# Altium schematic sheet MainPCB.SchDoc: Main PCB
size A3; DrawnBy: FeKunz; Revision: 1; SheetNumber: 1; SheetTotal: 1
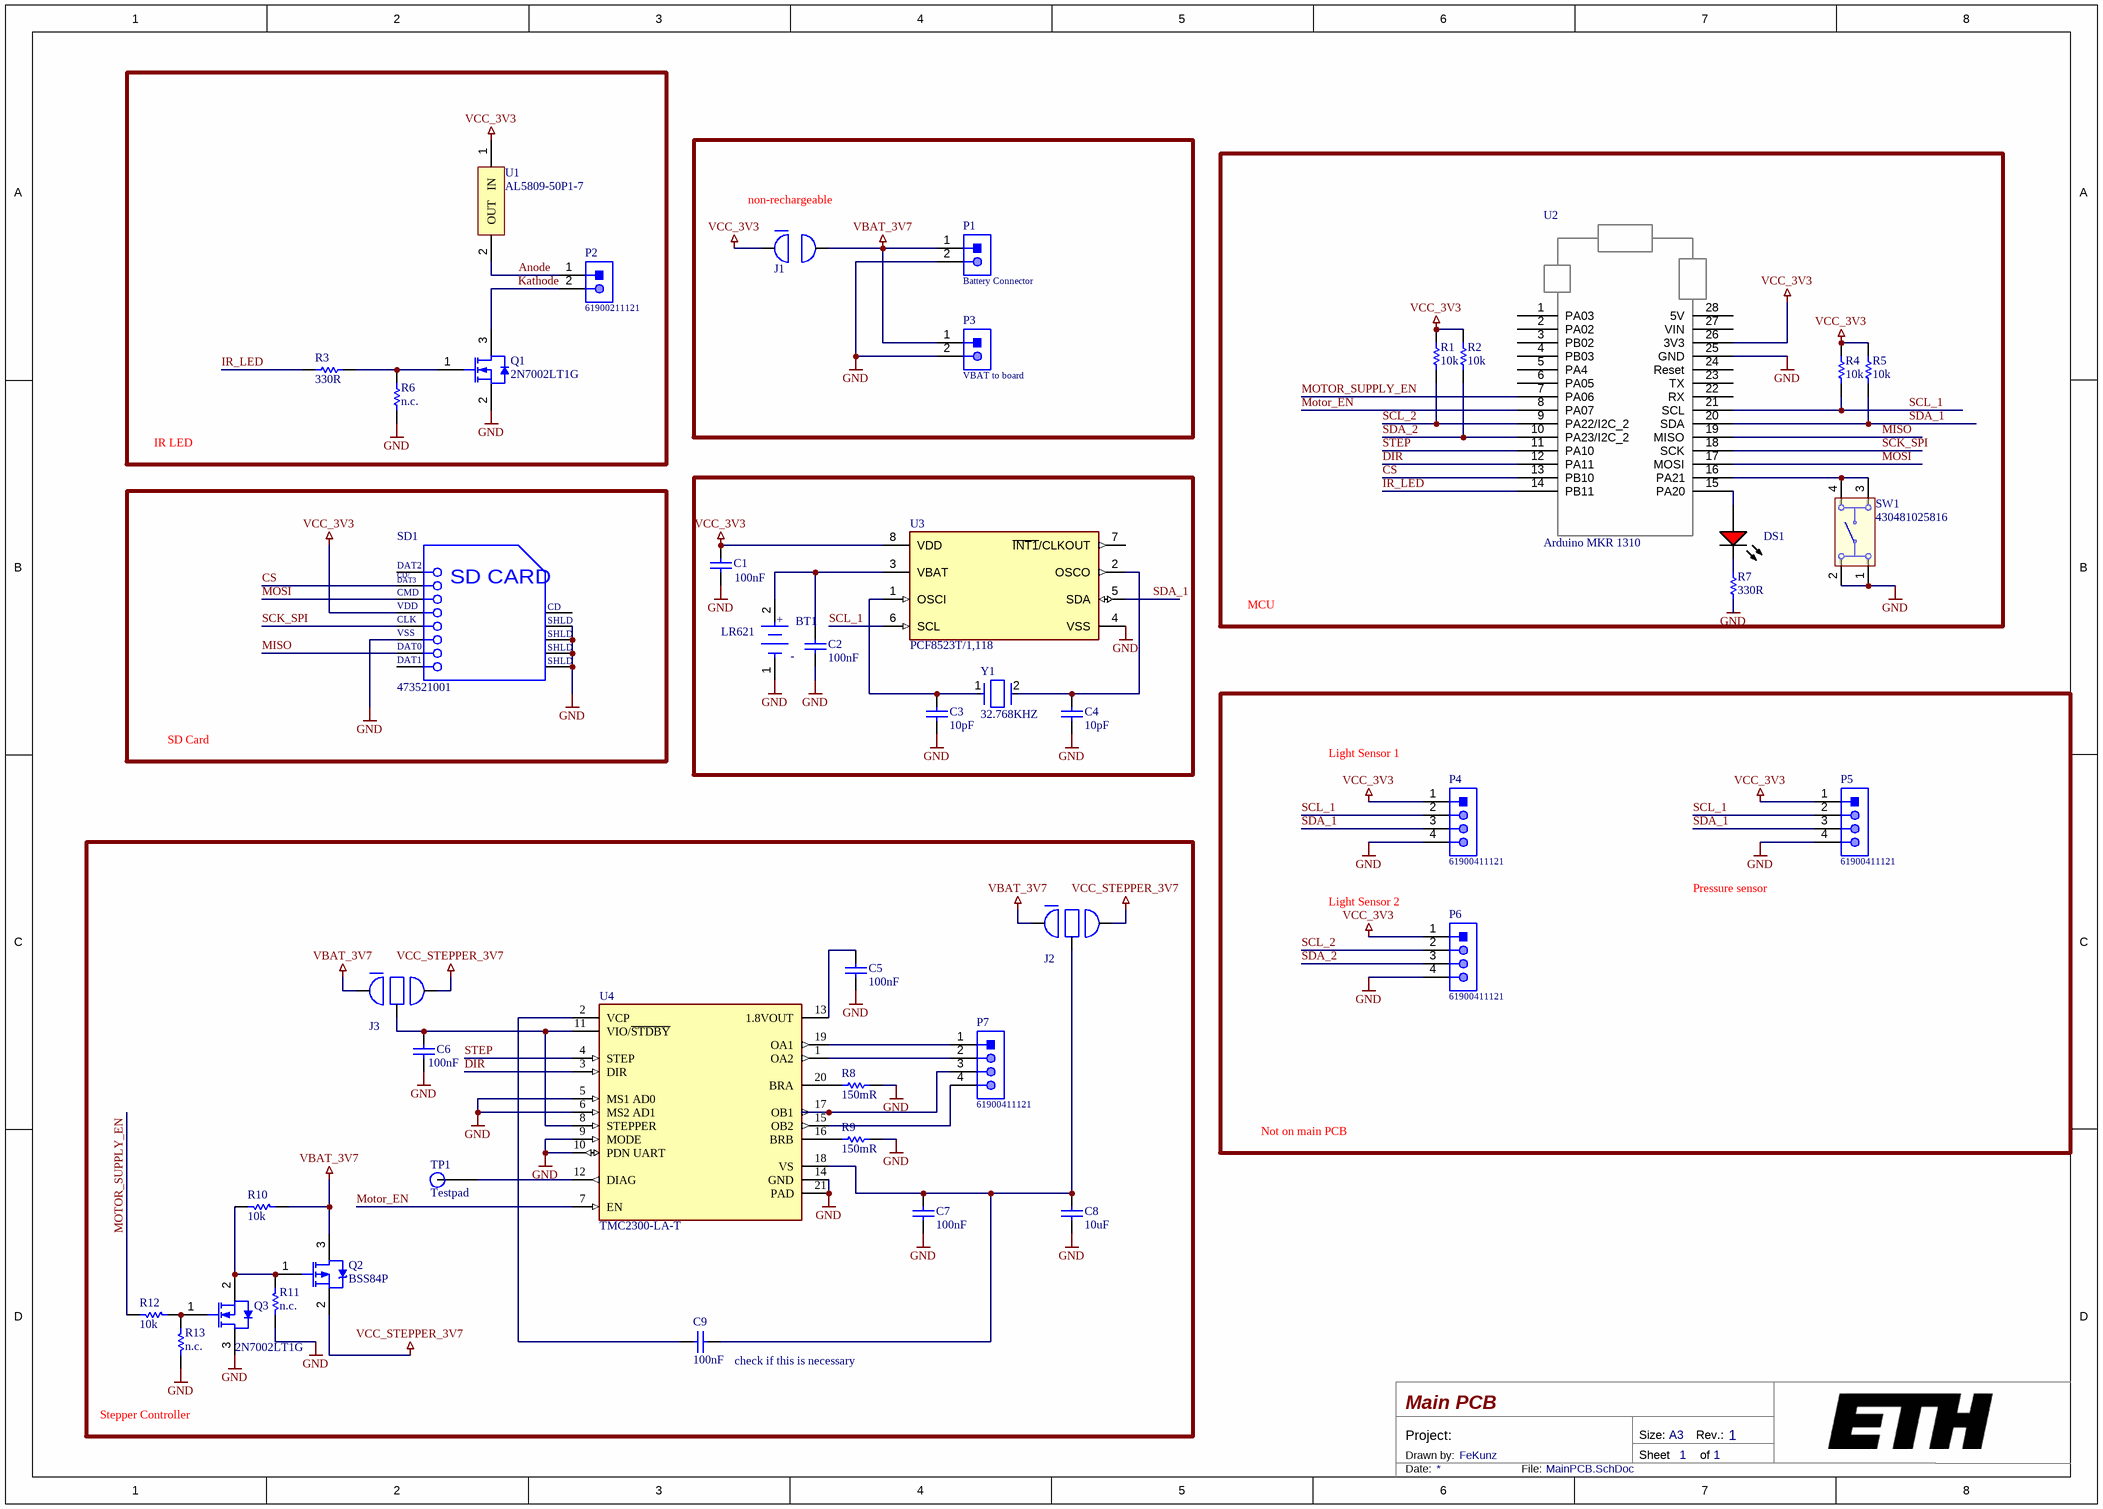
[diagram p0: MainPCB.SchDoc]

## Parts
BT1  LR621  [FP-2998-MFG]
C1  100nF  [CAPC2013X140X50NL20T25]
C2  100nF  [CAPC2013X140X50NL20T25]
C3  10pF  [CAPC2013X115X51NL20T26]
C4  10pF  [CAPC2013X115X51NL20T26]
C5  100nF  [CAPC2013X140X50NL20T25]
C6  100nF  [CAPC2013X140X50NL20T25]
C7  100nF  [CAPC2013X140X50NL20T25]
C8  10uF  [CAPC2013X140X45NL15T25]
C9  100nF  [CAPC2013X140X50NL20T25]
DS1  HSMH-C190  [AVAG-HSMX-C190_V]  (value not drawn)
J1  Jumper_2W  [2w_Jumper]  (value not drawn)
J2  Jumper_3W  [3W_Jumper]  (value not drawn)
J3  Jumper_3W  [3W_Jumper]  (value not drawn)
P1  Battery Connector  [61900211121]
P2  61900211121  [61900211121]
P3  VBAT to board  [61900211121]
P4  61900411121  [61900411121]
P5  61900411121  [61900411121]
P6  61900411121  [61900411121]
P7  61900411121  [61900411121]
Q1  2N7002LT1G  [ONSC-SOT-23-3-318-08_V]
Q2  BSS84P  [INF-PG-SOT23_N]
Q3  2N7002LT1G  [ONSC-SOT-23-3-318-08_V]
R1  10k  [RESC2013X60X35NL10T20]
R2  10k  [RESC2013X60X35NL10T20]
R3  330R  [RESC2013X60X40NL20T25]
R4  10k  [RESC2013X60X35NL10T20]
R5  10k  [RESC2013X60X35NL10T20]
R6  n.c.  [RESC2013X60X35NL10T20]
R7  330R  [RESC2013X60X35LL10T20]
R8  150mR  [RESC2013X70X40LL20T20]
R9  150mR  [RESC2013X70X40LL20T20]
R10  10k  [RESC2013X60X40NL20T25]
R11  n.c.  [RESC2013X60X35NL10T20]
R12  10k  [RESC2013X60X40NL20T25]
R13  n.c.  [RESC2013X60X35NL10T20]
SD1  473521001  [MOLX-473521001_V]
SW1  430481025816  [430481025816]
TP1  Testpad  [Testpad]
U1  AL5809-50P1-7  [DIOD-POWERDI123-2_B_V]
U2  Arduino MKR 1310  [ArduinoMKR]
U3  PCF8523T/1,118  [FP-SOT96-1-IPC_C]
U4  TMC2300-LA-T  [FP-TMC2300-LA-T-IPC_C]
Y1  32.768KHZ  [FP-ABS05-MFG]

## Blocks framed on the sheet
IR LED: P2 Q1 R3 R6 U1
non-rechargeable: J1 P1 P3
MCU: DS1 R1 R2 R4 R5 R7 SW1 U2
SD Card: SD1

## Nets
GND: BT1.1(C) C1.1 C2.1 C3.1 C4.1 C5.1 C6.1 C7.2 C8.1 P1.2 P3.2 P4.4 P5.4 P6.4 Q1.2(S) Q3.3(D) R6.1 R7.2 R8.2 R9.2 R11.2 R13.2 SD1.6(VSS) SD1.10(SHLD) SD1.11(SHLD) SD1.12(SHLD) SD1.13(SHLD) SW1.1 SW1.2 U2.25(GND) U3.4(VSS) U4.5(MS1_AD0) U4.6(MS2_AD1) U4.9(MODE) U4.10(PDN_UART) U4.14(GND) U4.21(PAD)
VBAT_3V7: J1.2 J2.1 J3.1 P1.1 P3.1 Q2.3(DRAIN) R10.2
VCC_3V3: C1.2 J1.1 P4.1 P5.1 P6.1 R1.2 R2.2 R4.2 R5.2 SD1.4(VDD) U1.1(IN) U2.26(3V3) U3.8(VDD)
VCC_STEPPER_3V7: J2.3 J3.3 Q2.2(SOURCE)
Anode: P2.1 U1.2(OUT)
CS: SD1.2(CD/DAT3) U2.13(PB10)
DIR: U2.12(PA11) U4.3(DIR)
IR_LED: R3.1 U2.14(PB11)
Kathode: P2.2 Q1.3(D)
MISO: SD1.7(DAT0) U2.19(MISO)
MOSI: SD1.3(CMD) U2.17(MOSI)
Motor_EN: U2.8(PA07) U4.7(EN)
MOTOR_SUPPLY_EN: R12.1 U2.7(PA06)
SCK_SPI: SD1.5(CLK) U2.18(SCK)
SCL_1: P4.2 P5.2 R4.1 U2.21(SCL) U3.6(SCL)
SCL_2: P6.2 R1.1 U2.9(PA22/I2C_2)
SDA_1: P4.3 P5.3 R5.1 U2.20(SDA) U3.5(SDA)
SDA_2: P6.3 R2.1 U2.10(PA23/I2C_2)
STEP: U2.11(PA10) U4.4(STEP)
NetBT1_2: BT1.2(A) C2.2 U3.3(VBAT)
NetC3_2: C3.2 U3.1(OSCI) Y1.1
NetC4_2: C4.2 U3.2(OSCO) Y1.2
NetC5_2: C5.2 U4.13(1.8VOUT)
NetC6_2: C6.2 J3.2 U4.8(STEPPER) U4.11(VIO/~{STDBY})
NetC7_1: C7.1 C8.2 C9.1 J2.2 U4.18(VS)
NetC9_2: C9.2 U4.2(VCP)
NetDS1_1: DS1.1(A) U2.15(PA20)
NetDS1_2: DS1.2(K) R7.1
NetP7_1: P7.1 U4.19(OA1)
NetP7_2: P7.2 U4.1(OA2)
NetP7_3: P7.3 U4.17(OB1)
NetP7_4: P7.4 U4.15(OB2)
NetQ1_1: Q1.1(G) R3.2 R6.2
NetQ2_1: Q2.1(GATE) Q3.2(S) R10.1 R11.1
NetQ3_1: Q3.1(G) R12.2 R13.1
NetR8_1: R8.1 U4.20(BRA)
NetR9_1: R9.1 U4.16(BRB)
NetSW1_3: SW1.3 SW1.4 U2.16(PA21)
NetTP1_1: TP1.1 U4.12(DIAG)

Not connected (* = marked no-connect by the designer): SD1 1(DAT2) 8(DAT1) 9(CD); U2 1(PA03) 2(PA02) 3(PB02) 4(PB03) 5(PA4) 6(PA05) 22(RX) 23(TX) 24(Reset) 27(VIN) 28(5V); U3 7(~{INT1}/CLKOUT)

## Notes on the sheet
- Light Sensor 1
- Light Sensor 2
- Pressure sensor
- Not on main PCB
- (near C9) check if this is necessary
- Stepper Controller
- Project:
- Drawn by:
- Size:
- Sheet
- A3
- Rev.:
- of
- Date:
- File:
- (in symbol CMP-2000-05848-1) CD/; DAT3; SD CARD
- (in symbol CMP-19636-000010-1) +; -

## Library data of the parts
BT1 = CMP-19636-000010-1: BATTERY RETAINER COIN 6.8MM SMD; Number of Batteries: 1; Package Quantity: 100; Mount: Surface Mount; Case/Package: SMD/SMT; Number of Cells: 1; REACH SVHC: No SVHC; Height: 2.9mm; Contact Material: Bronze; Material: Bronze; Lead Free: Lead Free; Termination: SMD/SMT; Color: Silver
C1 C2 C5-C7 C9 = CMP-2007-04629-1: Part Number: 08055C104K4Z2A; Manufacturer: AVX Interconnect / Elco
C3 C4 = CMP-2007-04860-1: Manufacturer: AVX Interconnect / Elco; Part Number: 08052U100GAT2A
C8 = CMP-2007-03395-1: Part Number: GRM21BR71A106KE51L; Manufacturer: Murata
DS1 = CMP-1744-00004-1: LED Uni-Color Red, 65 mW, 20 mA, -40 to 85 degC, 2-Pin SMD, RoHS, Tape and Reel; Connector Type: USB; Gender: Male; Current Rating: 1 A; Length: 7.5 mm; Lead Pitch: 0.65 mm; PackageReference: HSMX-C190; Package Quantity: 2000; Max Operating Temperature: 85 degC; PackageDescription: 2-Pin Surface Mount Device, Body 1.6 x 0.8 mm, Height 0.9 mm; ComponentLink3Description: Package Specification; Mount: Surface Mount; Min Operating Temperature: -30 degC; ComponentLink3URL: http://www.fairchildsemi.com/dwg/MA/MA03D.pdf; ComponentLink1Description: Manufacturer URL; Contact Material: Copper; Pins: 5; Width: 5.6 mm; ComponentLink2Description: Datasheet; RoHSCompliant: true; DatasheetVersion: Mar-12; Height: 2.8 mm; Packaging: Tape and Reel; Contact Plating: Gold; ComponentLink1URL: http://www.avagotech.com/; REACH SVHC: No SVHC; ComponentLink2URL: http://docs.avagotech.com/docs/AV02-0551EN
P1-P3 = CMP-1502-00584-1: Male Locking Header WR-WTB, THT, Vertical, pitch 2.54 mm, 1 x 2 position; Manufacturer: Wurth Elektronik; Position: 1x2; Contact Resistance: 20mOhm; Working Voltage: 250VAC; Pitch: 2.54mm; Gender: Male; Part Number: 61900211121; Mounting Technology: THT; Operating Temperature: -40to105degC; Orientation: Vertical; Packaging: Bag; Package Reference: 61900211121; Manufacturer URL: http://www.we-online.de; Datasheet URL: https://katalog.we-online.de/em/datasheet/6190xx11121.pdf; Publisher: WurthElektronik
P4-P7 = CMP-1502-00586-1: Male Locking Header WR-WTB, THT, Vertical, pitch 2.54 mm, 1 x 4 position; Manufacturer: Wurth Elektronik; Working Voltage: 250VAC; Pitch: 2.54mm; Contact Resistance: 20mOhm; Position: 1x4; Publisher: WurthElektronik; Manufacturer URL: http://www.we-online.de; Datasheet URL: https://katalog.we-online.de/em/datasheet/6190xx11121.pdf; Operating Temperature: -40to105degC; Packaging: Bag; Gender: Male; Package Reference: 61900411121; Orientation: Vertical; Mounting Technology: THT; Part Number: 61900411121
Q1 Q3 = CMP-1058-00781-1: Small Signal MOSFET, 60 V, 115 mA, N-Channel, 3-Pin SOT-23, Pb-Free, Tape and Reel; Manufacturer: On Semiconductor; Channel Polarity: N Channel; V(BR)DSS Min (V): 60; ID Max (A): 0.115; VGS Max (V): 20; Configuration: Single; VGS(th) Max (V): 2.5; ComponentLink1URL: http://www.onsemi.com/; ComponentLink3Description: Package Specification; ComponentLink3URL: http://www.onsemi.cn/pub_link/Collateral/318-08.PDF; PackageReference: SOT-23-3-318-08; RoHS: Pb-Free; ComponentLink2URL: http://www.onsemi.com/pub_link/Collateral/2N7002L-D.PDF; ComponentLink1Description: Manufacturer URL; Package Type: SOT-23-3; Packing: Tape and Reel; PartNumber: 2N7002LT1G; DatasheetVersion: Rev. 7; Mounting Technology: Surface Mount; ComponentLink2Description: Datasheet; PackageDescription: 3-Pin Small Outline Transistor, Body 2.92 x 1.3 mm, Pitch 0.95 mm; PackageVersion: Rev. AP, 11/2009
Q2 = CMP-1099-00028-1: P-Channel SIPMOS Small-Signal-Transistor, -60 V VDS, -0.17 A ID, -55 to 150 degC, PG-SOT23, Reel, Green; Manufacturer: Infineon; VGS(th) (max): -2Â V; VGS(th) (min): -1Â V; VDS (max): -60Â V; Rth: 350Â K/W; Pto t (max): 0.36Â W; ID (max): -0.17Â A; IDpuls (max): -0.68Â A; RDS (on) (max) (@4.5V): 12,000Â mOhm; QG: 1Â nC; Green: TRUE; RDS (on) (max): 8,000Â mOhm; ComponentLink3URL: http://www.infineon.com/dgdl/SOT23-Package_Overview.pdf?folderId=db3a30431936bc4b0119532290053c66&fileId=db3a30431936bc4b0119533468123c85; ComponentLink3Description: Package Specification; Packing: Reel; PartNumber: BSS84P; ComponentLink2Description: Datasheet; Mounting Technology: Surface Mount; ComponentLink2URL: http://www.infineon.com/dgdl/BSS84P_Rev2.7%5B1%5D.pdf?folderId=db3a304314dca38901154a72e3951a65&fileId=db3a304330f68606013118ac7a9b4549; PackageReference: PG-SOT23; ComponentLink1URL: http://www.infineon.com/; PackageVersion: Apr-08; ComponentLink1Description: Manufacturer URL; PackageDescription: 3-Pin Small Outline Transistor Package, 2.9 x 1.3 mm Body, 0.95 mm Pitch; Halogen-free: TRUE; DatasheetVersion: Rev. 2.7
R1 R2 R4-R6 R11 R13 = CMP-1659-00013-4: Chip Resistor, 10 KOhm, +/- 1%, 0.125 W, -55 to 155 degC, 0805 (2012 Metric), RoHS, Tape and Reel; Manufacturer: Yageo; Voltage Rating: 150 V; Mount: Surface Mount; ComponentLink1Description: Manufacturer URL; ComponentLink2URL: http://www.yageo.com/documents/recent/PYu-RC_Group_51_RoHS_L_04.pdf; Pins: 2; Length: 2 mm; Min Operating Temperature: -55 degC; Height: 0.5 mm; Mounting Technology: Surface Mount; RoHSCompliant: true; REACH SVHC: No SVHC; ComponentLink1URL: http://www.yageo.com/; Max Operating Temperature: 155 degC; PackageReference: 0805; DatasheetVersion: Rev. 4, 02/2016; Package Quantity: 5000; Packaging: Tape and Reel; ComponentLink2Description: Datasheet; PackageDescription: 2-Pin Surface Mounted Device, Body 2 x 1.25 mm
R3 R10 R12 = CMP-2001-00612-1: Manufacturer: Panasonic; Part Number: ERA6AEB221V
R7 = CMP-2000-06960-1: Chip Resistor, 330 Ohm, +/- 1%, 125 mW, -55 to 155 degC, 0805 (2012 Metric), RoHS, Tape and Reel; Manufacturer: Yageo; Voltage Rating: 150V; Temperature Coefficient: 100PPM/C; Power Rating: 125mW(1/8W); Resistance: 330Ohms; Datasheet Version: Rev. 7, 05/2017; Termination Style: SMD/SMT; Case Code - mm: 2012; Package Description: 2-Pin Surface Mounted Device, Body 2 x 1.25 mm; Operating Temperature Range: -55Cto+155C; Case Code - in: 0805; Packaging: Reel; Tolerance: 1%; Package Reference: 0805; Mounting Technology: SurfaceMount; Product: ThickFilmResistorsGeneralPurpose; Series: RC; Manufacturer URL: http://www.yageo.com/; Datasheet URL: http://www.yageo.com/documents/recent/PYu-RC_Group_51_RoHS_L_7.pdf
R8 R9 = CMP-2001-00505-1: Manufacturer: Panasonic; Part Number: ERJ6BSFR15V
SD1 = CMP-2000-05848-1: MicroSD(TM), Pitch 1.1 mm, 8 Position, Height 1.88 mm, -20 to 85 degC, RoHS, Tape and Reel; Manufacturer: Molex; Datasheet Version: Rev. G, 01/2012; Datasheet URL: http://www.molex.com/pdm_docs/sd/473521001_sd.pdf; Package Reference: 473521001; Manufacturer URL: http://www.molex.com/; Mounting Technology: SurfaceMount; Package Description: MicroSD(TM), Pitch 1.1 mm, 8 Position, Height 1.88 mm
SW1 = CMP-1452-00025-1: WS-TASV SMD Tact Switch 6X6 mm; Manufacturer: Wuerth Elektronik; NoPins: 04; ComponentLink1Description: Manufacturer URL; ComponentLink2Description: Datasheet; PackageReference: 430481025816; ComponentLink2URL: http://katalog.we-online.de/em/datasheet/4304x1.pdf; ComponentLink1URL: http://www.we-online.com; PartNumber: 430481025816
U1 = CMP-2100-00296-1: Constant Current LED Driver, 2.5 to 60 V, -40 to 125 degC, 2-Pin SMD, RoHS, Tape and Reel
U2 = Arduino MKR
U3 = CMP-10083-000014-1: IC RTC CLK/CALENDAR I2C 8-SOIC; Time Format: HH:MM:SS; Min Supply Voltage: 1.2V; Max Supply Voltage: 5.5V; Logic Function: Clock; Min Operating Temperature: -40°C; Case/Package: SO; Radiation Hardening: No; Interface: I2C; Max Operating Temperature: 85°C; Contact Plating: Gold; Packaging: Tape and Reel; Package Quantity: 2500; Lead Free: Lead Free; Number of Pins: 8; Mount: Surface Mount; REACH SVHC: No SVHC
U4 = CMP-237673-000009-1: LOW VOLTAGE MOTOR DRIVER 2-11V Q
Y1 = CMP-27762-008890-1: CRYSTAL 32.7680KHZ 12.5PF SMD; Tolerance: 20ppm; Series Resistance: 90kR; Series: ABS05; RoHS Compliant: Yes; Operating Frequency: 32.768 kHz; Length: 1.6mm; Depth: 1mm; Case/Package: SMD/SMT; Max Operating Temperature: 85°C; Mount: Surface Mount; Frequency: 32.768kHz; Number of Pins: 2; Width: 0.039inch; ESR (Equivalent Series Resistance): 90kR; Height: 0.02inch; Min Operating Temperature: -40°C; Radiation Hardening: No; Frequency Tolerance: 20ppm; Lead Free: Lead Free; Package Quantity: 3000; Packaging: Tape and Reel; Termination: SMD/SMT; REACH SVHC: No SVHC; Load Capacitance: 12.5pF